# Altium schematic sheet 08_BATT.SchDoc
size A4
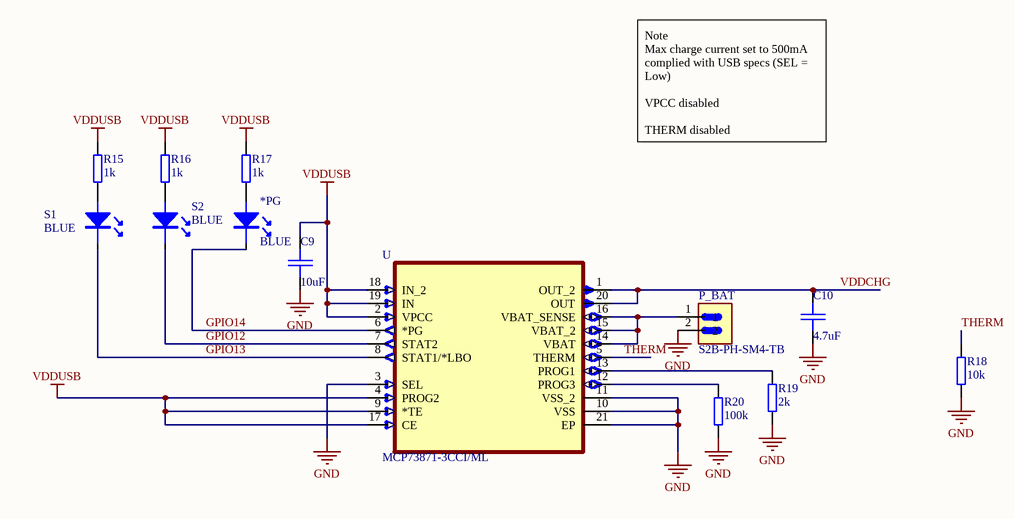
[diagram p0: 08_BATT.SchDoc]

## Parts
*PG  BLUE  [SMT_LED_0603]
C9  10uF  [SMT_C_0402]
C10  4.7uF  [SMT_C_0402]
P_BAT  S2B-PH-SM4-TB  [JST_S2B-PH-SM4-TB]
R15  1k  [SMT_R_0402]
R16  1k  [SMT_R_0402]
R17  1k  [SMT_R_0402]
R18  10k  [SMT_R_0402]
R19  2k  [SMT_R_0402]
R20  100k  [SMT_R_0402]
S1  BLUE  [SMT_LED_0603]
S2  BLUE  [SMT_LED_0603]
U  MCP73871-3CCI/ML  [MCP73871-3CCI/ML]

## Nets
GND: C9.2 C10.2 P_BAT.2 R18.1 R19.1 R20.1 U.3(SEL) U.10(VSS) U.11(VSS_2) U.21(EP)
VDDUSB: C9.1 R15.2 R16.2 R17.2 U.2(VPCC) U.4(PROG2) U.9(*TE) U.17(CE) U.18(IN_2) U.19(IN)
GPIO12: S2.2(K) U.7(STAT2)
GPIO13: S1.2(K) U.8(STAT1/*LBO)
GPIO14: *PG.2(K) U.6(*PG)
THERM: R18.2 U.5(THERM)
VDDCHG: C10.1 U.1(OUT_2) U.20(OUT)
Net*PG_1: *PG.1(A) R17.1
NetP_BAT_1: P_BAT.1 U.14(VBAT) U.15(VBAT_2) U.16(VBAT_SENSE)
NetR15_1: R15.1 S1.1(A)
NetR16_1: R16.1 S2.1(A)
NetR19_2: R19.2 U.13(PROG1)
NetR20_2: R20.2 U.12(PROG3)

## Notes on the sheet
- Note
  Max charge current set to 500mA complied with USB specs (SEL = Low)
  VPCC disabled
  THERM disabled

## Library data of the parts
*PG S1 S2 = SMT_LED_0603: SMT LED
C9 C10 = SMT_C_0402: Surface mount capacitor 0402
P_BAT = S2B-PH-SM4-TB: Connector Header Surface Mount, Right Angle 2 position 0.079 _2.00mm_; MF: JST Sales; SnapEDA_Link: https://www.snapeda.com/parts/S2B-PH-SM4-TB/JST%20Sales%20America%20Inc./view-part/225866/?ref=snap; Value: *; Price: None; Availability: Unavailable; MP: S2B-PH-SM4-TB; Package: None
R15-R20 = SMT_R_0402: Surface mount resistor 0402
U = MCP73871-3CCI/ML: Charger IC Lithium Ion/Polymer 20-QFN _4x4_; MF: Microchip; MP: MCP73871-3CCI/ML; Package: QFN-20 Microchip; Price: None; Availability: Unavailable; SnapEDA_Link: https://www.snapeda.com/parts/MCP73871-3CCI/ML/Microchip/view-part/276296/?ref=snap; Value: *